# Altium schematic sheet numpad.SchDoc
size A4; SheetNumber: 1; SheetTotal: 1
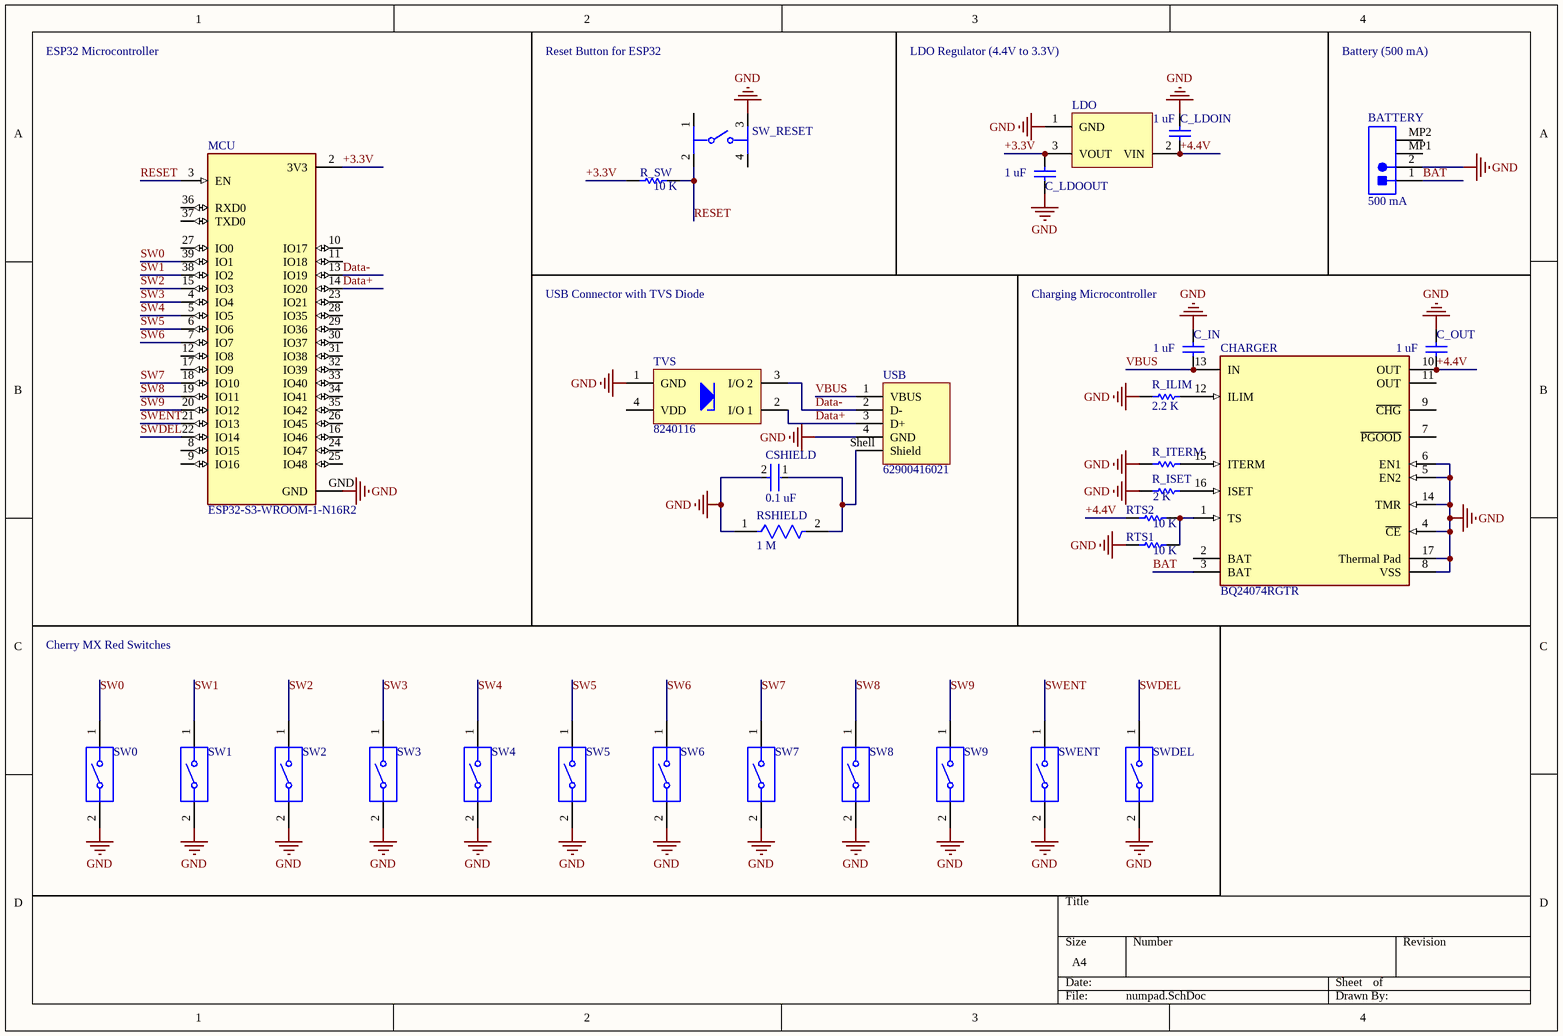
[diagram p0: numpad.SchDoc]

## Parts
BATTERY  500 mA  [JST- S2B-PH-SM4-TB(LF)(SN)-2_V]
C_IN  1 uF  [CAPC1608X87X35LL15T15]
C_LDOIN  1 uF  [CAPC1608X87X35LL15T15]
C_LDOOUT  1 uF  [CAPC1608X87X35LL15T15]
C_OUT  1 uF  [CAPC1608X87X35LL15T15]
CHARGER  BQ24074RGTR  [FP-RGT0016C-IPC_B]
CSHIELD  0.1 uF  [FP-GRM15-MFG]
LDO  MCP1700-3302E/TO  [TO-92-TO3]  (value not drawn)
MCU  ESP32-S3-WROOM-1-N16R2  [XCVR_ESP32-S3-WROOM-1-N16R2]
R_ILIM  2.2 K  [RESC1608X55X25LL10T15]
R_ISET  Part Number: 2 K  [RESC1609X50X30ML10T20]  (hidden comment: CRCW)
R_ITERM  RC04  [RESC1005X40X25LL05T10]  (value not drawn)
R_SW  10 K  [RESC1005X40X25LL05T10]
RSHIELD  1 M  [FP-MCR01-IPC_A]
RTS1  10 K  [RESC1005X40X25LL05T10]
RTS2  10 K  [RESC1005X40X25LL05T10]
SW0  MX1A-11NW  [CHRY-MX1A-11NW_V]  (value not drawn)
SW1  MX1A-11NW  [CHRY-MX1A-11NW_V]  (value not drawn)
SW2  MX1A-11NW  [CHRY-MX1A-11NW_V]  (value not drawn)
SW3  MX1A-11NW  [CHRY-MX1A-11NW_V]  (value not drawn)
SW4  MX1A-11NW  [CHRY-MX1A-11NW_V]  (value not drawn)
SW5  MX1A-11NW  [CHRY-MX1A-11NW_V]  (value not drawn)
SW6  MX1A-11NW  [CHRY-MX1A-11NW_V]  (value not drawn)
SW7  MX1A-11NW  [CHRY-MX1A-11NW_V]  (value not drawn)
SW8  MX1A-11NW  [CHRY-MX1A-11NW_V]  (value not drawn)
SW9  MX1A-11NW  [CHRY-MX1A-11NW_V]  (value not drawn)
SW_RESET  3-1825910-1  [FP-3-1825910-1-MFG]  (value not drawn)
SWDEL  MX1A-11NW  [CHRY-MX1A-11NW_V]  (value not drawn)
SWENT  MX1A-11NW  [CHRY-MX1A-11NW_V]  (value not drawn)
TVS  8240116  [WE-TVS_SOT143-4L]
USB  62900416021  [62900416021]

## Nets
GND: BATTERY.2 C_IN.2 C_LDOIN.2 C_LDOOUT.1 C_OUT.2 CHARGER.4(~{CE}) CHARGER.5(EN2) CHARGER.6(EN1) CHARGER.8(VSS) CHARGER.14(TMR) CHARGER.17(Thermal_Pad) CSHIELD.2 LDO.1(GND) MCU.GND R_ILIM.1 R_ISET.1 R_ITERM.1 RSHIELD.1 RTS1.1 SW0.2 SW1.2 SW2.2 SW3.2 SW4.2 SW5.2 SW6.2 SW7.2 SW8.2 SW9.2 SW_RESET.3 SWDEL.2 SWENT.2 TVS.1(GND) USB.4(GND)
+3.3V: C_LDOOUT.2 LDO.3(VOUT) MCU.2(3V3) R_SW.1
+4.4V: C_LDOIN.1 C_OUT.1 CHARGER.10(OUT) LDO.2(VIN) RTS2.1
BAT: BATTERY.1 CHARGER.3(BAT)
Data+: MCU.14(IO20) TVS.2(I/O_1) USB.3(D+)
Data-: MCU.13(IO19) TVS.3(I/O_2) USB.2(D-)
RESET: MCU.3(EN) R_SW.2 SW_RESET.2
SW0: MCU.39(IO1) SW0.1
SW1: MCU.38(IO2) SW1.1
SW2: MCU.15(IO3) SW2.1
SW3: MCU.4(IO4) SW3.1
SW4: MCU.5(IO5) SW4.1
SW5: MCU.6(IO6) SW5.1
SW6: MCU.7(IO7) SW6.1
SW7: MCU.18(IO10) SW7.1
SW8: MCU.19(IO11) SW8.1
SW9: MCU.20(IO12) SW9.1
SWDEL: MCU.22(IO14) SWDEL.1
SWENT: MCU.21(IO13) SWENT.1
VBUS: C_IN.1 CHARGER.13(IN) USB.1(VBUS)
NetCHARGER_1: CHARGER.1(TS) RTS1.2 RTS2.2
NetCHARGER_12: CHARGER.12(ILIM) R_ILIM.2
NetCHARGER_15: CHARGER.15(ITERM) R_ITERM.2
NetCHARGER_16: CHARGER.16(ISET) R_ISET.2
NetCSHIELD_1: CSHIELD.1 RSHIELD.2 USB.Shell(Shield)

Not connected (* = marked no-connect by the designer): BATTERY MP1 MP2; CHARGER 2(BAT) 7(~{PGOOD}) 9(~{CHG}) 11(OUT); MCU 8(IO15) 9(IO16) 10(IO17) 11(IO18) 12(IO8) 16(IO46) 17(IO9) 23(IO21) 24(IO47) 25(IO48) 26(IO45) 27(IO0) 28(IO35) 29(IO36) 30(IO37) 31(IO38) 32(IO39) 33(IO40) 34(IO41) 35(IO42) 36(RXD0) 37(TXD0); SW_RESET 1 4; TVS 4(VDD)

## Notes on the sheet
- ESP32 Microcontroller
- Reset Button for ESP32
- LDO Regulator (4.4V to 3.3V)
- Battery (500 mA)
- USB Connector with TVS Diode
- (near C_IN) Charging Microcontroller
- Cherry MX Red Switches

## Library data of the parts
BATTERY = CMP-1755-00001-1: Male Header, Pitch 2 mm, 1 x 2 Position, Height 5.5 mm, -25 to 85 degC, RoHS, Tape and Reel; Current Rating: 3 A; ComponentLink1URL: http://www.jst.com/home2.html; Radiation Hardening: No; RoHSCompliant: True; Mount: Through Hole; Contact Material: Bronze; Package Quantity: 100; Width: 2.34 mm; DatasheetVersion: Dec-12; Height: 8.13 mm; Max Operating Temperature: 105degC; ComponentLink2Description: Datasheet; Lead Pitch: 0.1 inch; Contact Finish: Lead; Packaging: Bulk; Colour: Black; Contact Plating: Tin; Min Operating Temperature: -65degC; ComponentLink1Description: Manufacturer URL; PackageReference: S2B-PH-SM4-TB(LF)(SN)-2; PackageDescription: Male Header, Pitch 2 mm, 1 x 2 Position, Height 5.5 mm; ComponentLink2URL: http://www.jst-mfg.com/product/pdf/eng/ePH.pdf; Pins: 40; Length: 101.19 mm
C_IN C_LDOIN C_LDOOUT C_OUT = CMP-2006-03713-1: Part Number: C0603C105K3RACTU; Manufacturer: Kemet
CHARGER = CMP-0321-00220-3: IC LI-ION CHARGE MGMT 16-QFN; Fault Protection: Over Voltage; Max Charge Current: 1.5A; Interface: USB; Max Supply Voltage: 10.2V; Number of Cells: 1; Battery Pack Voltage: 4.2V; Min Supply Voltage: 4.35V; Battery Chemistry: LITHIUM-ION; Min Input Voltage: 4.3V; Lead Free: Lead Free; Max Operating Temperature: 125°C; RoHS Compliant: Yes; Contact Plating: Gold; Min Operating Temperature: -40°C; Weight: 0.000808oz; Package Quantity: 3000; Radiation Hardening: No; Case/Package: VQFN; Output Voltage: 4.2V; Packaging: Tape and Reel; Series: -; Output Current: 1.5A; Number of Pins: 16
CSHIELD = CMP-2100-03641-2: CAP CER 0.1UF 16V X7R 0402; Manufacturer Part Number: GRM155R71C104KA88D; Manufacturer: Murata; Standoff Height: 0mm; Tolerance: 10%; Voltage Rating: 16Vdc; Capacitance: 0.10μF; Value: 0.10μF; RoHS: TRUE; Temperature Characteristic: X7R; Octopart: https://octopart.com/grm155r71c104ka88d-murata-196880; Digikey Description: CAP CER 0.1UF 16V X7R 0402; Device Class L3: Ceramic Capacitors; Height: 0.55mm; ComponentLink2Description: Datasheet; Temperature Range Low: -55°C; Ipc Land Pattern Name: CAPC10050X219; ComponentLink2URL: https://search.murata.co.jp/Ceramy/image/img/A01X/G101/ENG/GRM155R71H471KA01-01A.pdf; Device Class L1: Passive Components; Lead Free: yes; Category: Cap; Package: GRM15; Temperature: -55°C to +125°C; Device Class L2: Capacitors; Material: Ceramic; Temperature Range High: +125°C; Mouser Description: 0402 0.1 uF 16V ±10 % Tolerance X7R SMT Multilayer Ceramic Capacitor
LDO = CMP-0136-00007-1: Low Quiescent Current LDO, 3-Pin TO-92, Extended TemperatureBAG; PackageReference: TO-92-TO3; PackageDescription: 3-Lead Plastic Transistor Outline (TO) [TO-92]; DatasheetVersion: revB, Feb-2007; PackageVersion: revBB, Aug-2009
MCU = CMP-003-000000-1: Bluetooth, WiFi 802.11b/g/n, Bluetooth v5.0 Transceiver Module 2.4GHz PCB Trace Surface Mount; MF: Espressif Systems; MP: ESP32S3WROOM1N16R2; Source: ESP32-S3-WROOM-1-N16R2.SchLib; Pin Count: 39; Value: *; Check_prices: https://www.snapeda.com/parts/ESP32S3WROOM1N16R2/Espressif+Systems/view-part/?ref=eda; Package: NON STANDARD Espressif Systems; Component Type: Standard; Design Item ID: ESP32-S3-WROOM-1-N16R2; SnapEDA_Link: https://www.snapeda.com/parts/ESP32S3WROOM1N16R2/Espressif+Systems/view-part/?ref=snap
R_ILIM = CMP-2000-06934-1: Thick Film Resistor, 2.2 KOhm, 100 mW, 50 V, +/- 1%, -55 to 155 degC, 2-Pin SMD (0603), RoHS, Tape and Reel; Manufacturer: Yageo; Resistance: 2.2kOhms; Temperature Coefficient: 100PPM/C; Voltage Rating: 50V; Power Rating: 100mW; Tolerance: 1%; Datasheet Version: Rev. 7, 05/2017; Case Code - mm: 1608; Series: RC; Mounting Technology: SurfaceMount; Package Description: 2-Pin Surface Mount Device, Body 1.6 x 0.8 mm; Case Code - in: 0603; Package Reference: 0603; Product: ThickFilmResistorsGeneralPurpose; Manufacturer URL: http://www.yageo.com/; Termination Style: SMD/SMT; Operating Temperature Range: -55Cto+155C; Datasheet URL: http://www.yageo.com/documents/recent/PYu-RC_Group_51_RoHS_L_7.pdf; Packaging: Reel
R_ISET = CMP-2000-03159-1: Manufacturer: Vishay Dale
R_ITERM R_SW RTS1 RTS2 = CMP-2002-07353-1: Part Number: RC0402FR-0710KL; Manufacturer: Yageo / Phycomp
RSHIELD = CMP-08839-004923-1: Thick Film Chip Resistor, 0402, 1MΩ, 5%, 200ppm/°C, 0.063W, 50V; Max Power Dissipation: 63mW; Resistance: 1MR; Resistor Type: Thick Film; Temperature Coefficient: 200ppm/°C; Series: MCR; Case Code (Metric): 1005; Min Operating Temperature: -55°C; Case Code (Imperial): 0402; Length: 0.039inch; Height: 0.016inch; RoHS Compliant: Yes; Tolerance: 5%; Width: 0.02inch; Packaging: Tape and Reel; Package Quantity: 1; Max Operating Temperature: 155°C; Voltage Rating (DC): 50V; Case/Package: 0402; Number of Terminations: 2
SW0-SW9 SWDEL SWENT = CMP-2000-06786-1: Keylock Switch, 12 V, -10 to 70 degC, 2-Pin THD, RoHS, Bulk; Manufacturer: Cherry; Part No: MX1A11NW; Maximum DC Voltage Rating: 12V; COO: UK; Row Spacing: 6.35mm; Pole Throw Configuration: SPST; Total Travel: 4.06mm; Illumination Type: N/R; Actuator Style: Button; Operating Force: 0.58N; Electrical Life: 50000000Cycle; Minimum Insulation Resistance: 100MOhm; Body Orientation: Straight; Actuator Length: 3.6mm; Switch Configuration: N.O.; Maximum Current Rating: 0.01A; Maximum Contact Resistance: 200mOhm; Actuator Color: N/A; Terminal Type: PCPins; Operating Temperature: -10to70C; Number of Terminals: 2; Operating Speed: N/A; Maximum AC Voltage Rating: 12V; Housing Material: N/A; Datasheet URL: https://cdn.sparkfun.com/datasheets/Components/Switches/MX%20Series.pdf; Type: DesktopProfile; Terminal Pitch: 2.54mm; Package Reference: MX1A-11NW; ECCN: EAR99; Family: MX; Packaging: N/A; HTS: 8536509065; Actuator Material: N/A; Package Description: 2-Pin Through Hole Device, Body 15.6 x 15.6 mm; Dielectric Strength: N/A; Illumination Color: N/R; Manufacturer URL: http://cherryswitches.com/cn/; Dimension: 15.6x15.6x15.2mm; Mechanical Life: N/A; RoHS: Unknown; Contact Plating: N/A; Supplier: CherryElectrical; Contact Material: Silver/Gold; IP Rating: N/A; Mounting: ThroughHole; Datasheet Version: 09/2000; Maximum Power Rating: N/A; Mounting Technology: ThroughHole
SW_RESET = CMP-03407-000001-1: SWITCH TACTILE SPST-NO 0.05A 24V; Manufacturer: TE Connectivity; Operating Force: 160gf; Contact Current Rating: 50mA; Contact Resistance: 100mΩ; Electromechanical Life: 100000Cycles; Device Class L1: Electromechanical; ComponentLink2URL: https://www.te.com/commerce/DocumentDelivery/DDEController?Action=srchrtrv&DocNm=1825910&DocType=Customer+Drawing&DocLang=English; Category: Switch; Device Class L2: Switches; Temperature: -35°C to +85°C; RoHS: TRUE; Mount: Through Hole; Manufacturer Part Number: 3-1825910-1; Automotive: No; Lead Free: Yes; Device Class L3: Tactile Switches; ComponentLink2Description: Datasheet; Temperature Range High: +85°C; Height: 17.3mm; Package: 0; Temperature Range Low: -35°C; Throw Configuration: SPST-NO; Digikey Description: SWITCH TACTILE SPST-NO 0.05A 24V; Octopart: https://octopart.com/3-1825910-1-te+connectivity-46506874
TVS = CMP-1486-00003-2: NexarPartId: 18190098; Element Configuration: Dual; Leakage Current: 5µA; Capacitance: 2pF; Peak Pulse Current: 12A; Working Voltage: 5V; Number of Channels: 2; Clamping Voltage: 7.8V; Power Line Protection: Yes; Polarity: Bidirectional; Min Breakdown Voltage: 6.1V; Forward Voltage: 700mV; Direction: Unidirectional; Test Current: 1mA; Max Reverse Leakage Current: 5A; Width: 2.4mm; Mount: Surface Mount; Reverse Standoff Voltage: 5V; Max Operating Temperature: 125°C; Packaging: Cut Tape (CT); Case/Package: SOT-143; RoHS: Compliant; Height: 1.06mm; ESD Protection: Yes; REACH SVHC: No SVHC; Max Surge Current: 12A; Min Operating Temperature: -55°C; Number of Pins: 4; Length: 2.92mm; Termination: SMD/SMT; Number of Bidirectional Channels: 2; Breakdown Voltage: 6.1V; Max Breakdown Voltage: 6.1V
USB = CMP-1502-03240-2: NexarPartId: 19991170; Number of Contacts: 4; Insulation Resistance: 1GΩ; Connector Type: USB; Contact Resistance: 20mΩ; Gender: Receptacle; Current Rating: 1.5A; Operating Supply Voltage: 30V; USB Standard: USB 2.0; Packaging: Cut Tape; Contact Plating: Gold; REACH SVHC: Unknown; Orientation: Horizontal; RoHS: Compliant; Features: Shielded; Length: 14.4mm; Max Operating Temperature: 105°C; Number of Pins: 4; Termination: SMD/SMT; Lead Free: Lead Free; Min Operating Temperature: -40°C; Mount: Horizontal, Surface Mount